# EasyEDA Pro project 16V3_EDA.eprj

# Schematic Schematic1
Board Name: Board1; Create Date: 2025-01-20; Page Name: P1; Project Name: 16V3_EDA; Schematic Name: Schematic1; Update Date: 2025-02-12; Company: 嘉立创EDA; Page Size: A4; Version: V1.0
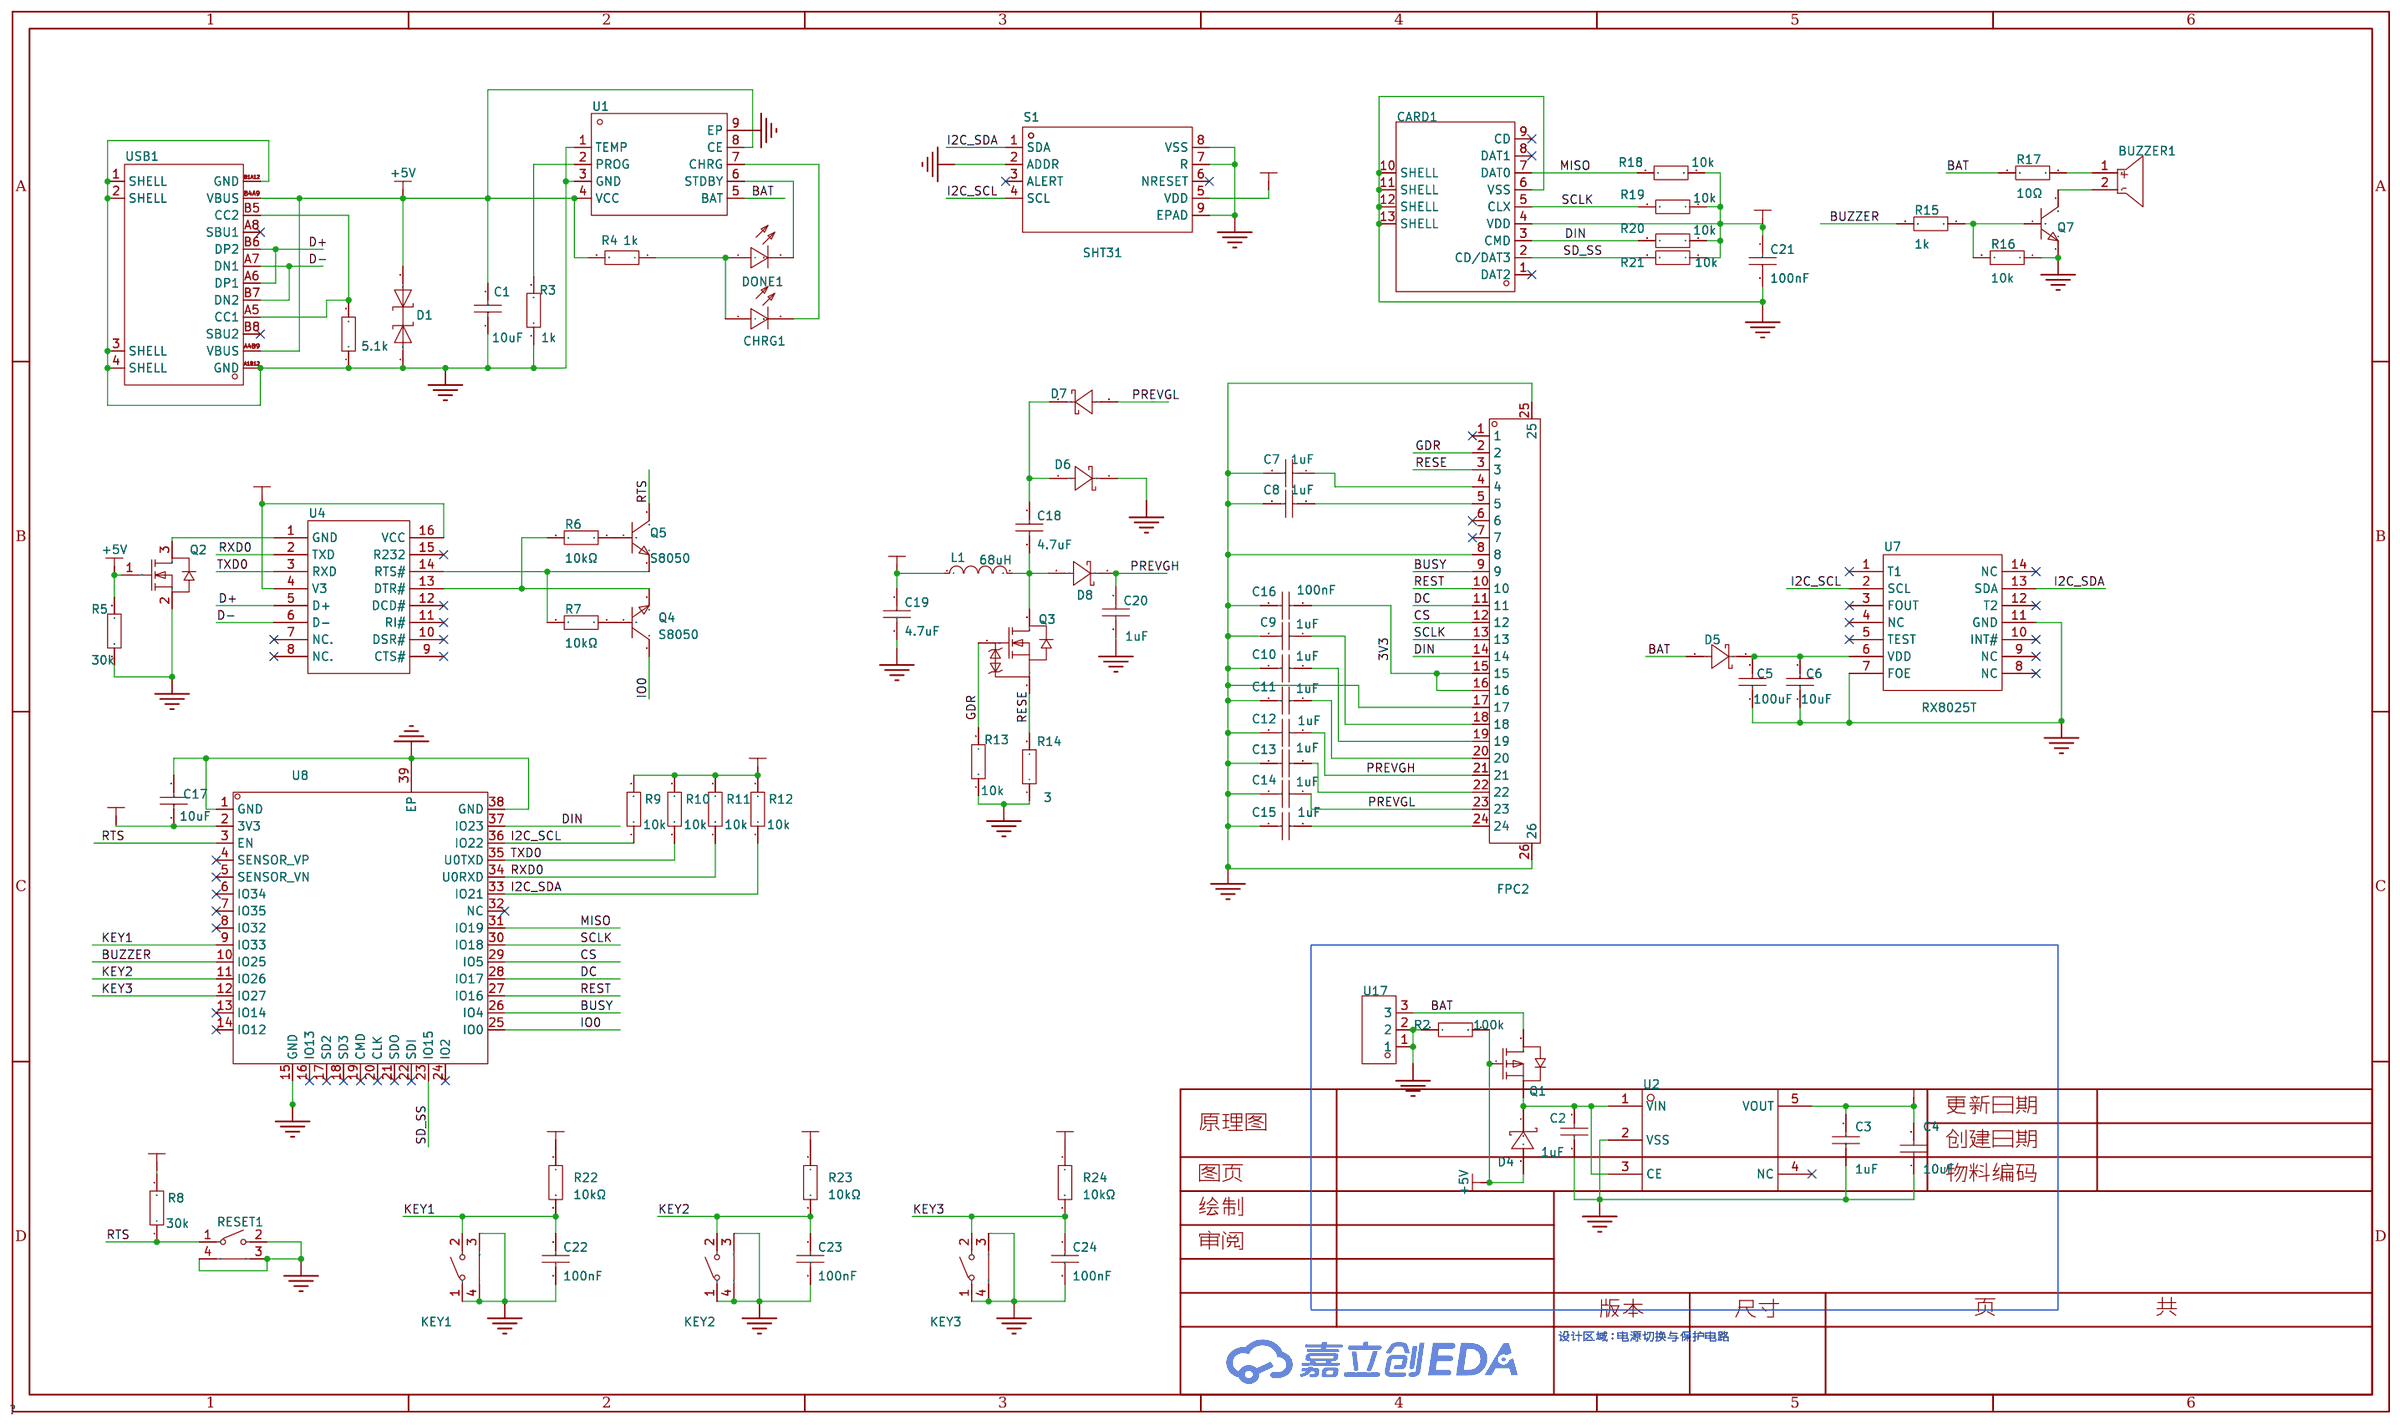
[diagram p0: schematic sheet]

## Parts
BUZZER1  FMQ-BUZZER2  [BUZ-TH_BD12.0-P7.60-D0.6-FD]
C1  10uF  [C0603]
C2  1uF  [C0603]
C3  1uF  [C0603]
C4  10uF  [C0603]
C5  100uF  [C0603]
C6  10uF  [C0603]
C7  1uF  [C0603]
C8  1uF  [C0603]
C9  1uF  [C0603]
C10  1uF  [C0603]
C11  1uF  [C0603]
C12  1uF  [C0603]
C13  1uF  [C0603]
C14  1uF  [C0603]
C15  1uF  [C0603]
C16  100nF  [C0603]
C17  10uF  [C0603]
C18  4.7uF  [C0603]
C19  4.7uF  [C0603]
C20  1uF  [C0603]
C21  100nF  [C0603]
C22  100nF  [C0603]
C23  100nF  [C0603]
C24  100nF  [C0603]
CARD1  -  [TF-SMD_THD2528-11SD-GF]
CHRG1  -  [LED0603-R-RD]
D1  -  [SOD-523_L1.2-W0.8-LS1.6-BI]
D4  -  [SMA_L4.3-W2.6-LS5.1-RD]
D5  -  [SOD-123_L2.7-W1.6-LS3.7-RD-1]
D6  -  [SOD-123_L2.7-W1.6-LS3.7-RD-1]
D7  -  [SOD-123_L2.7-W1.6-LS3.7-RD-1]
D8  -  [SOD-123_L2.7-W1.6-LS3.7-RD-1]
DONE1  -  [LED0603-R-RD]
FPC2  -  [FPC-SMD_24P-L17.5-W5.4-P0.50]
KEY1  -  [SW-SMD_L4.7-W3.5-P3.35-EH]
KEY2  -  [SW-SMD_L4.7-W3.5-P3.35-EH]
KEY3  -  [SW-SMD_L4.7-W3.5-P3.35-EH]
L1  68uH  [IND-SMD_L4.0-W4.0]
Q1  -  [SOT-23_L2.9-W1.3-P1.90-LS2.4-BR]
Q2  -  [SOT-23_L2.9-W1.3-P1.90-LS2.4-BR]
Q3  -  [SOT-323_L2.0-W1.3-P1.30-LS2.1-BR]
Q4  S8050  [SOT-23-3_L3.0-W1.7-P0.95-LS2.9-BR]
Q5  S8050  [SOT-23-3_L3.0-W1.7-P0.95-LS2.9-BR]
Q7  S8050-J3Y  [SOT-23-3_L3.0-W1.7-P0.95-LS2.9-BR]
R1  5.1k  [R0603]
R2  100k  [R0603]
R3  1k  [R0603]
R4  1k  [R0603]
R5  30k  [R0603]
R6  10kΩ  [R0603]
R7  10kΩ  [R0603]
R8  30k  [R0603]
R9  10k  [R0603]
R10  10k  [R0603]
R11  10k  [R0603]
R12  10k  [R0603]
R13  10k  [R0603]
R14  3  [R0603]
R15  1k  [R0603]
R16  10k  [R0603]
R17  10Ω  [R0603]
R18  10k  [R0603]
R19  10k  [R0603]
R20  10k  [R0603]
R21  10k  [R0603]
R22  10kΩ  [R0603]
R23  10kΩ  [R0603]
R24  10kΩ  [R0603]
RESET1  -  [SW-SMD_L4.7-W3.5-P3.35-EH]
S1  SHT31  [DFN-8_L2.5-W2.5-P0.50-BL-EP]
U1  -  [ESOP-8_L4.9-W3.9-P1.27-LS6.0-BL-EP]
U2  -  [SOT_23_5]
U4  -  [SOP-16_L10.0-W3.9-P1.27-LS6.0-BL]
U7  RX8025T  [SOIC-14_L10.0-W5.5-P1.27-LS7.8-BL]
U8  -  [WIRELM-SMD_ESP32-S]
U17  ZX-XH2.54-3PZZ  [CONN-TH_3P-P2.54_2501S-3P]
USB1  -  [USB-SMD_TYPE-611S-T3]

## Library data of the parts
BUZZER1 = FMQ-BUZZER2: Supplier Part: C9900006103; Supplier Footprint: 插件; JLCPCB Part Class: 扩展库; Supplier: LCSC
C1 C4 C6 C17 = CC0805KRX7R9BB104: 容值:100nF;精度:±10%;额定电压:50V;温度系数:X7R;; LCSC Part Name: 100nF ±10% 50V; Supplier Part: C15850; Manufacturer: YAGEO(国巨); Supplier Footprint: 0805; JLCPCB Part Class: Basic Part; Datasheet: https://atta.szlcsc.com/upload/public/pdf/source/20151026/1457707504898.pdf; Supplier: LCSC; Tolerance: ±10%; Voltage Rated: 50V; Temperature Coefficient: X7R
C2 C3 C7-C15 C20 = CC0805KRX7R9BB104: 容值:100nF;精度:±10%;额定电压:50V;温度系数:X7R;; LCSC Part Name: 100nF ±10% 50V; Supplier Part: C15849; Manufacturer: YAGEO(国巨); Supplier Footprint: 0603; JLCPCB Part Class: Basic Part; Datasheet: https://atta.szlcsc.com/upload/public/pdf/source/20151026/1457707504898.pdf; Supplier: LCSC; Tolerance: ±10%; Voltage Rated: 50V; Temperature Coefficient: X7R
C5 C18 = CC0805KRX7R9BB104: 容值:100nF;精度:±10%;额定电压:50V;温度系数:X7R;; LCSC Part Name: 100nF ±10% 50V; Supplier Part: C49678; Manufacturer: YAGEO(国巨); Supplier Footprint: 0805; JLCPCB Part Class: Basic Part; Datasheet: https://atta.szlcsc.com/upload/public/pdf/source/20151026/1457707504898.pdf; Supplier: LCSC; Tolerance: ±10%; Voltage Rated: 50V; Temperature Coefficient: X7R
C16 = CC0805KRX7R9BB104: 容值:100nF;精度:±10%;额定电压:50V;温度系数:X7R;; LCSC Part Name: 100nF ±10% 50V; Supplier Part: C14663; Manufacturer: YAGEO(国巨); Supplier Footprint: 0603; JLCPCB Part Class: Basic Part; Datasheet: https://atta.szlcsc.com/upload/public/pdf/source/20151026/1457707504898.pdf; Supplier: LCSC; Tolerance: ±10%; Voltage Rated: 50V; Temperature Coefficient: X7R
C19 = CC0805KRX7R9BB104: 容值:100nF;精度:±10%;额定电压:50V;温度系数:X7R;; LCSC Part Name: 100nF ±10% 50V; Supplier Part: C19666; Manufacturer: YAGEO(国巨); Supplier Footprint: 0603; JLCPCB Part Class: Basic Part; Datasheet: https://atta.szlcsc.com/upload/public/pdf/source/20151026/1457707504898.pdf; Supplier: LCSC; Tolerance: ±10%; Voltage Rated: 50V; Temperature Coefficient: X7R
C21 = CC0805KRX7R9BB104: 容值:100nF;精度:±10%;额定电压:50V;温度系数:X7R;; LCSC Part Name: 100nF ±10% 50V; Supplier Part: C14663; Manufacturer: YAGEO(国巨); Supplier Footprint: 0805; JLCPCB Part Class: Basic Part; Datasheet: https://atta.szlcsc.com/upload/public/pdf/source/20151026/1457707504898.pdf; Supplier: LCSC; Tolerance: ±10%; Voltage Rated: 50V; Temperature Coefficient: X7R
C22-C24 = CC0805KRX7R9BB104: 容值:100nF;精度:±10%;额定电压:50V;温度系数:X7R;; LCSC Part Name: 100nF ±10% 50V; Supplier Part: C49678; Manufacturer: YAGEO(国巨); Supplier Footprint: 0603; JLCPCB Part Class: Basic Part; Datasheet: https://atta.szlcsc.com/upload/public/pdf/source/20151026/1457707504898.pdf; Supplier: LCSC; Tolerance: ±10%; Voltage Rated: 50V; Temperature Coefficient: X7R
CARD1 = THD2528-11SD-GF: 卡连接方式:自弹式;卡类型:MicroSD卡(TF卡);连接器类型:卡座;本体最大高度:2mm;工作温度范围:-;; LCSC Part Name: 自弹式 MicroSD卡(TF卡) 卡座 外焊; Supplier Part: C283232; Manufacturer: THD(台华达); Supplier Footprint: SMD; Datasheet: https://atta.szlcsc.com/upload/public/pdf/source/20190329/C283232_532F94C79FB51CC42613BF324E8B5690.pdf; Supplier: LCSC; Card Connection Mode: 自弹式; Card Type: MicroSD卡(TF卡); Connector Type: 卡座; Maximum Body Height: 2mm; JLCPCB Part Class: Extended Part
CHRG1 = 19-217/R6C-AL1M2VY/3T: 发光颜色:红灯;二极管配置:-;透镜颜色:无色透明;主波长:617.5nm;峰值波长:632nm;色温:-;光通量(25时):-;测试电流:5mA;正向电压(VF):2.2V;发光强度:28.5mcd;功率:60mW;发光角度:120°;安装方式:-;工作温度:-40~+85;; LCSC Part Name: 0603 红灯; Supplier Part: C2286; Manufacturer: EVERLIGHT(台湾亿光); Supplier Footprint: 0603; Datasheet: https://atta.szlcsc.com/upload/public/pdf/source/20160507/1462613613821.pdf; Supplier: LCSC; Emitted Color: 红灯; Lens Color: 无色透明; Dominant Wavelength: 617.5nm; Peak Wavelength: 632nm; Forward Current: 5mA; Forward Voltage (VF): 2.2V; Luminous Intensity: 28.5mcd; Power Dissipation: 60mW; Viewing Angle: 120°; Operating Temperature: -40~+85; JLCPCB Part Class: Extended Part
D1 = ESD5Z5.0VC: 极性:双向;反向截止电压(Vrwm):5V@(最大值);击穿电压(最小值):5.6V;峰值脉冲电流(Ipp)@10/1000s:4A;最大钳位电压:12V;; LCSC Part Name: 双向 5V@(最大值); Supplier Part: C261278; Manufacturer: TC(德昌); Supplier Footprint: SOD-523; Datasheet: https://atta.szlcsc.com/upload/public/pdf/source/20180801/C261278_4236068C2349B5255C3720AC1205D526.pdf; Supplier: LCSC; Polarity: 双向; Reverse Stand-Off Voltage (Vrwm): 5V@(最大值); Breakdown Voltage (Min): 5.6V; Peak Pulse Current (Ipp)@10/1000μs: 4A; Maximum Clamping Voltage: 12V; JLCPCB Part Class: Extended Part
D4 = SS34: 直流反向耐压(Vr):40V;平均整流电流(Io):3A;正向压降(Vf):550mV@3A;; LCSC Part Name: 40V 3A 550mV@3A (SMA打扁); Supplier Part: C355267; Manufacturer: SINO-IC(光宇睿芯); Supplier Footprint: SMA; Datasheet: https://atta.szlcsc.com/upload/public/pdf/source/20190731/C355267_DFDD47B37D7A4339E7036B819780E55C.pdf; Supplier: LCSC; Reverse Voltage (Vr): 40V; Average Rectified Current (Io): 3A; Forward Voltage (Vf@If): 550mV@3A; JLCPCB Part Class: Extended Part
D5-D8 = MBR0530_C699108: 直流反向耐压(Vr):30V;平均整流电流(Io):500mA;正向压降(Vf):550mV@500mA;; LCSC Part Name: 30V 500mA 550mV@500mA; Supplier Part: C699108; Manufacturer: YANGJIE(扬杰); Manufacturer Part: MBR0530; Supplier Footprint: SOD-123; Datasheet: https://atta.szlcsc.com/upload/public/pdf/source/20200709/C699108_94C8F1A54679DD603C9696C8694A3BC2.pdf; Supplier: LCSC; Reverse Voltage (Vr): 30V; Average Rectified Current (Io): 500mA; Forward Voltage (Vf@If): 550mV@500mA; JLCPCB Part Class: Extended Part
DONE1 = 19-217/R6C-AL1M2VY/3T: 发光颜色:绿灯;二极管配置:-;透镜颜色:无色透明;主波长:617.5nm;峰值波长:632nm;色温:-;光通量(25时):-;测试电流:5mA;正向电压(VF):2.2V;发光强度:28.5mcd;功率:60mW;发光角度:120°;安装方式:-;工作温度:-40~+85;; LCSC Part Name: 0603 红灯; Supplier Part: C72043; Manufacturer: EVERLIGHT(台湾亿光); Supplier Footprint: 0603; Datasheet: https://atta.szlcsc.com/upload/public/pdf/source/20160507/1462613613821.pdf; Supplier: LCSC; Emitted Color: 绿灯; Lens Color: 无色透明; Dominant Wavelength: 617.5nm; Peak Wavelength: 632nm; Forward Current: 5mA; Forward Voltage (VF): 2.2V; Luminous Intensity: 28.5mcd; Power Dissipation: 60mW; Viewing Angle: 120°; Operating Temperature: -40~+85; JLCPCB Part Class: Extended Part
FPC2 = AFC07-S24ECC-00: 间距:0.5mm;触点数量:24;锁定特性:抽屉式;安装类型:卧贴;触点类型:上接;; LCSC Part Name: 0.5mm P数:24 抽屉式 上接; Supplier Part: C11092; Manufacturer: JS(钜硕电子); Supplier Footprint: SMD,P=0.5mm; Datasheet: https://atta.szlcsc.com/upload/public/pdf/source/20151024/1457707484416.pdf; Supplier: LCSC; Pitch: 0.5mm; Number of Contacts: 24; Locking Feature: 抽屉式; Mounting Type: 卧贴; Contact Type: 上接; Height Above Board: 2mm; FFC, FCB Thickness: 0.3mm; JLCPCB Part Class: Extended Part
KEY1-KEY3 RESET1 = GT-TC018B-H0375-L1: 触点电流:50mA;额定电压(DC):12V;绝缘电阻:100MΩ;电路结构:单刀单掷;安装方式:卧贴;按钮形状:矩形按钮;按钮/盖帽颜色:黑色;带灯:无;作用力:250gf@±30gf;机械寿命:100000;工作温度:-30~+85;引脚样式:SMD接片;开关长度:4.7mm;开关宽度:1.9mm;开关高度:3.75mm;带支架:否;; LCSC Part Name: 243.75侧按轻触开关; Supplier Part: C2762970; Manufacturer: G-Switch(品赞); Supplier Footprint: SMD; JLCPCB Part Class: Extended Part; Datasheet: https://atta.szlcsc.com/upload/public/pdf/source/20201201/C963235_1379E8FB9A9D5A830B16F6A18B8D18DC.pdf; Supplier: LCSC; Contact Current: 50mA; Voltage Rating (DC): 12V; Insulation Resistance: 100MΩ; Circuit: 单刀单掷; Mounting Style: 卧贴; Actuator Style: 矩形按钮; Actuator/Cap Color: 黑色; With Lamp: 无; Operating Force: 250gf@±30gf; Mechanical Life: 100000; Operating Temperature: -30~+85; Pin Style: SMD接片; Switch Length: 4.7mm; Switch Width: 1.9mm; Switch Height: 3.75mm; Strike Gundam: 否
L1 = CR4020-680M: 电感值:68uH;精度:±20%;额定电流:-;直流电阻(DCR):-;; LCSC Part Name: 68uH ±20%; Supplier Part: C520318; Manufacturer: ceaiya(柯爱亚); Supplier Footprint: SMD; Datasheet: https://atta.szlcsc.com/upload/public/pdf/source/20200424/C520276_8639ABF18B4A41322D74F24464FD005B.pdf; Supplier: LCSC; Tolerance: ±20%; JLCPCB Part Class: Extended Part
Q1 = SI2305: 类型:P沟道;漏源电压(Vdss):20V;连续漏极电流(Id):4.1A;功率(Pd):1.25W;导通电阻(RDS(on)@Vgs,Id):52m@4.5V,4.1A;阈值电压(Vgs(th)@Id):1V@250A;; LCSC Part Name: P沟道 20V 4.1A; Supplier Part: C344006; Manufacturer: BORN伯恩半导体; Supplier Footprint: SOT-23; Datasheet: https://atta.szlcsc.com/upload/public/pdf/source/20181211/C344006_B14C481D34E4DBCC9865316765F4D8FD.pdf; Supplier: LCSC; Type: P沟道; Drain Source Voltage (Vdss): 20V; Continuous Drain Current (Id): 4.1A; Power Dissipation (Pd): 1.25W; Drain Source On Resistance (RDS(on)@Vgs,Id): 52m@4.5V,4.1A; Gate Threshold Voltage (Vgs(th)@Id): 1V@250A; JLCPCB Part Class: Extended Part
Q2 = AO3402: LCSC Part Name: 场效应管(MOSFET); Supplier Part: C2938369; Manufacturer: GOODWORK(固得沃克); Supplier Footprint: SOT23; JLCPCB Part Class: Extended Part; Datasheet: https://atta.szlcsc.com/upload/public/pdf/source/20211229/104159C48197010484F8CEA4AB274E1B.pdf; Supplier: LCSC
Q3 = SI1308EDL-T1-GE3: 类型:N沟道;漏源电压(Vdss):30V;连续漏极电流(Id):1.4A;功率(Pd):400mW;导通电阻(RDS(on)@Vgs,Id):132m@10V,1.4A;阈值电压(Vgs(th)@Id):1.5V@250A;; LCSC Part Name: N沟道 30V 1.4A; Supplier Part: C469327; Manufacturer: VISHAY(威世); Supplier Footprint: SOT-323; Datasheet: https://atta.szlcsc.com/upload/public/pdf/source/20191217/C469327_3FE8BCBB7604A1B1F6779A1D9DD725BB.pdf; Supplier: LCSC; Type: N沟道; Drain Source Voltage (Vdss): 30V; Continuous Drain Current (Id): 1.4A; Power Dissipation (Pd): 400mW; Drain Source On Resistance (RDS(on)@Vgs,Id): 132m@10V,1.4A; Gate Threshold Voltage (Vgs(th)@Id): 1.5V@250A; JLCPCB Part Class: Extended Part
Q4 = S8050: Pin Type: IN; Supplier: LCSC; Manufacturer: CJ; image: //image.lceda.cn/szlcsc/C2146.jpg; Supplier Part: C2146; JLCPCB Part Class: 基础库
Q5 = S8050: Supplier: LCSC; Manufacturer: CJ; image: //image.lceda.cn/szlcsc/C2146.jpg; Supplier Part: C2146; JLCPCB Part Class: 基础库; JLCPCB SMD: Yes
Q7 = S8050-J3Y: Pin Type: IN; Supplier: LCSC; Supplier Part: C364312; Manufacturer: (MDD) Jiangsu Yutai Elec; JLCPCB Part Class: Extended Part
R1 = TR0603B10K0P0525Z: 电阻类型:薄膜电阻;阻值:10k;精度:±0.1%;功率:100mW;温度系数:±25ppm/;最大工作电压:75V;工作温度范围:-55~+155;; LCSC Part Name: 10k ±0.1% 100mW; Supplier Part: C23186; Manufacturer: EVER OHMS(天二科技); Supplier Footprint: 0603; JLCPCB Part Class: Extended Part; Datasheet: https://atta.szlcsc.com/upload/public/pdf/source/20190415/C188363_433BF05B6FB8F7A0F5F35A3E4390C55A.pdf; Supplier: LCSC; Type: 薄膜电阻; Tolerance: ±0.1%; Power(Watts): 100mW; Temperature Coefficient: ±25ppm/; Overload Voltage (Max): 75V; Operating Temperature Range: -55~+155
R2 = TR0603B10K0P0525Z: 电阻类型:薄膜电阻;阻值:10k;精度:±0.1%;功率:100mW;温度系数:±25ppm/;最大工作电压:75V;工作温度范围:-55~+155;; LCSC Part Name: 10k ±0.1% 100mW; Supplier Part: C25803; Manufacturer: EVER OHMS(天二科技); Supplier Footprint: 0603; JLCPCB Part Class: Extended Part; Datasheet: https://atta.szlcsc.com/upload/public/pdf/source/20190415/C188363_433BF05B6FB8F7A0F5F35A3E4390C55A.pdf; Supplier: LCSC; Type: 薄膜电阻; Tolerance: ±0.1%; Power(Watts): 100mW; Temperature Coefficient: ±25ppm/; Overload Voltage (Max): 75V; Operating Temperature Range: -55~+155
R3 R4 R15 = TR0603B10K0P0525Z: 电阻类型:薄膜电阻;阻值:10k;精度:±0.1%;功率:100mW;温度系数:±25ppm/;最大工作电压:75V;工作温度范围:-55~+155;; LCSC Part Name: 10k ±0.1% 100mW; Supplier Part: C21190; Manufacturer: EVER OHMS(天二科技); Supplier Footprint: 0603; JLCPCB Part Class: Extended Part; Datasheet: https://atta.szlcsc.com/upload/public/pdf/source/20190415/C188363_433BF05B6FB8F7A0F5F35A3E4390C55A.pdf; Supplier: LCSC; Type: 薄膜电阻; Tolerance: ±0.1%; Power(Watts): 100mW; Temperature Coefficient: ±25ppm/; Overload Voltage (Max): 75V; Operating Temperature Range: -55~+155
R5 R8 = TR0603B10K0P0525Z: 电阻类型:薄膜电阻;阻值:10k;精度:±0.1%;功率:100mW;温度系数:±25ppm/;最大工作电压:75V;工作温度范围:-55~+155;; LCSC Part Name: 10kΩ ±0.1% 100mW; Supplier Part: C22984; Manufacturer: EVER OHMS(天二科技); Supplier Footprint: 0603; JLCPCB Part Class: Extended Part; Datasheet: https://atta.szlcsc.com/upload/public/pdf/source/20190415/C188363_433BF05B6FB8F7A0F5F35A3E4390C55A.pdf; Supplier: LCSC; Type: 薄膜电阻; Tolerance: ±0.1%; Power(Watts): 100mW; Temperature Coefficient: ±25ppm/; Overload Voltage (Max): 75V; Operating Temperature Range: -55~+155
R6 R7 = TR0603B10K0P0525Z: 电阻类型:薄膜电阻;阻值:10k;精度:±0.1%;功率:100mW;温度系数:±25ppm/;最大工作电压:75V;工作温度范围:-55~+155;; LCSC Part Name: 10kΩ ±0.1% 100mW; Supplier Part: C188363; Manufacturer: EVER OHMS(天二科技); Supplier Footprint: 0603; JLCPCB Part Class: Extended Part; Datasheet: https://atta.szlcsc.com/upload/public/pdf/source/20190415/C188363_433BF05B6FB8F7A0F5F35A3E4390C55A.pdf; Supplier: LCSC; Type: 薄膜电阻; Tolerance: ±0.1%; Power(Watts): 100mW; Temperature Coefficient: ±25ppm/; Overload Voltage (Max): 75V; Operating Temperature Range: -55~+155
R9-R14 R16 R18-R24 = TR0603B10K0P0525Z: 电阻类型:薄膜电阻;阻值:10k;精度:±0.1%;功率:100mW;温度系数:±25ppm/;最大工作电压:75V;工作温度范围:-55~+155;; LCSC Part Name: 10k ±0.1% 100mW; Supplier Part: C188363; Manufacturer: EVER OHMS(天二科技); Supplier Footprint: 0603; JLCPCB Part Class: Extended Part; Datasheet: https://atta.szlcsc.com/upload/public/pdf/source/20190415/C188363_433BF05B6FB8F7A0F5F35A3E4390C55A.pdf; Supplier: LCSC; Type: 薄膜电阻; Tolerance: ±0.1%; Power(Watts): 100mW; Temperature Coefficient: ±25ppm/; Overload Voltage (Max): 75V; Operating Temperature Range: -55~+155
R17 = 0603WAF100JT5E: 电阻类型:厚膜电阻;阻值:10Ω;精度:±1%;功率:100mW;; LCSC Part Name: 10Ω ±1% 100mW; Supplier Part: C22859; Manufacturer: UNI-ROYAL(厚声); Supplier Footprint: 0603; JLCPCB Part Class: Basic Part; Datasheet: https://atta.szlcsc.com/upload/public/pdf/source/20200306/C422600_1E6D84923E4A46A82E41ADD87F860B5C.pdf; Supplier: LCSC; Type: 厚膜电阻; Tolerance: ±1%; Power(Watts): 100mW; Temperature Coefficient: ±400ppm/℃; Overload Voltage (Max): 75V; Operating Temperature Range: -55℃~+155℃
S1 = SHT31-DIS-B: 1-101386-01; Supplier: LCSC; Manufacturer: Sensirion(瑞士盛思锐); Supplier Part: C80862; JLCPCB Part Class: 扩展库; LCSC Part Name: SHT31-DIS-B2.5kS; Supplier Footprint: DFN-8-EP(2.5x2.5); Datasheet: https://atta.szlcsc.com/upload/public/pdf/source/20230202/324039AB95BA3D329FC29BEE4FBFDB91.pdf; Supply Voltage: 2.15V~5.5V
U1 = TP4056: 充电电池的类型:-;电池单元组数:-;最大充电电流:-;充满的电池组电压:-;最大供应电压:-;; Supplier Part: C725790; Manufacturer: UMW(友台半导体); Supplier Footprint: ESOP-8; Datasheet: https://atta.szlcsc.com/upload/public/pdf/source/20211011/37515E71BA298E23D23475482C49633D.pdf; Supplier: LCSC; JLCPCB Part Class: Extended Part
U2 = LDO
U4 = CH340C: 类型:Transceiver;协议类别:USB 2.0;驱动器/接收器数:-;数据速率:2Mbps;; Supplier Part: C84681; Manufacturer: WCH(南京沁恒); Supplier Footprint: SOP-16_150mil; Datasheet: https://atta.szlcsc.com/upload/public/pdf/source/20200819/C84681_ADBED554CE321879DBD6B1D06488689C.pdf; Supplier: LCSC; Type: Transceiver; Protocol: USB 2.0; Data Rate: 2Mbps; Supply Voltage: 3.3V, 5V; JLCPCB Part Class: Extended Part
U7 = RX8025T-UB: 时钟芯片类型:Clock/Calendar;存储器容量:-;时间格式:HH:MM:SS;日期格式:YY-MM-DD;接口类型:I2C;; LCSC Part Name: RX8025T-UB(X1B000281000400); Supplier Part: C17353; Manufacturer: EPSON(爱普生); Supplier Footprint: SOP-14_208mil; Datasheet: https://atta.szlcsc.com/upload/public/pdf/source/20160318/1458266986300.pdf; Supplier: LCSC; Type: Clock/Calendar; Features: Alarm; Time Format: HH:MM:SS; Date Format: YY-MM-DD; Interface: I2C; Voltage - Supply: 1.8V ~ 5.5V; Current - Timekeeping (Max): 3.4A @ 5V; JLCPCB Part Class: Extended Part
U8 = ESP32-S_1: LCSC Part Name: ESP32-S; Supplier Part: C277944; Manufacturer: Ai-Thinker(安信可); Manufacturer Part: ESP32-S; Supplier Footprint: SMD Module; Datasheet: https://atta.szlcsc.com/upload/public/pdf/source/20211217/F4BEA33E732D6002D10DAED85BBCB52B.pdf; Supplier: LCSC; JLCPCB Part Class: Extended Part
U17 = ZX-XH2.54-3PZZ: 插针结构:1x3P;间距:2.54mm;安装方式:直插;参考系列:XH;总PIN数:3P;排数:1;每排PIN数:3;行距:-;额定电流:3A;触头材质:黄铜;触头镀层:锡;工作温度范围:-25℃~+85℃;; Supplier Part: C7429633; Manufacturer: Megastar(兆星); Supplier Footprint: 插件,P=2.54mm; JLCPCB Part Class: 扩展库; Datasheet: https://atta.szlcsc.com/upload/public/pdf/source/20230619/AE17037A2CFDBE8D9CBA775D61AD0A84.pdf; Supplier: LCSC; Pins Structure: 1x3P; Pitch: 2.54mm; Mounting Style: 直插; Reference Series: XH; Number of Pins: 3P; Number of Rows: 1; Number of PINs Per Row: 3; Current Rating (Max): 3A; Contact Material: 黄铜; Contact Plating: 锡; Operating Temperature Range: -25℃~+85℃
USB1 = TYPE-611S-T3: 连接器类型:Type-C;标准:-;公母:母座;触点数量:16;端口数量:1;安装方式:卧贴;额定电流 - 电源:3A;工作温度范围:-25~+85;; LCSC Part Name: Type-C 母座 卧贴 端子镀金8.94x7.3x3.16mm; Supplier Part: C2874595; Manufacturer: Yuandi(台湾元迪); Supplier Footprint: SMD; JLCPCB Part Class: Extended Part; Datasheet: https://atta.szlcsc.com/upload/public/pdf/source/20210810/BECE640E8A6D64F3BF313A26DC5F68B7.pdf; Supplier: LCSC; Connector Type: Type-C; Gender: 母座; Number of Contacts: 16; Number of Ports: 1; Mounting Style: 卧贴; Current Rating - Power (Max): 3A; Operating Temperature Range: -25~+85

## Nets
3V3: C3.2 C4.2 C16.1 C17.1 C19.1 C21.1 CARD1.4(VDD) FPC2.15 FPC2.16 L1.1 R8.2 R9.2 R10.2 R11.2 R12.2 R18.1 R19.1 R20.1 R21.1 R22.1 R23.1 R24.1 S1.5(VDD) U2.5(VOUT) U4.4(V3) U4.16(VCC) U8.2(3V3)
+5V: C1.2 D1.2 D4.2(A) Q1.1(G) Q2.1(G) R2.2 R4.2 R5.2 U1.4(VCC) U1.8(CE) USB1.A4B9(VBUS) USB1.B4A9(VBUS)
GND: C1.1 C2.1 C3.1 C4.1 C5.1 C6.1 C7.2 C8.2 C9.2 C10.2 C11.2 C12.2 C13.2 C14.2 C15.2 C16.2 C17.2 C19.2 C20.2 C21.2 C22.2 C23.2 C24.2 CARD1.6(VSS) CARD1.10(SHELL) CARD1.11(SHELL) CARD1.12(SHELL) CARD1.13(SHELL) D1.1 D6.1(K) FPC2.8 FPC2.17 FPC2.25 FPC2.26 KEY1.1 KEY1.3 KEY1.4 KEY2.1 KEY2.3 KEY2.4 KEY3.1 KEY3.3 KEY3.4 Q2.2(S) Q7.2(E) R1.1 R2.1 R3.1 R5.1 R13.1 R14.1 R16.1 RESET1.2 RESET1.3 RESET1.4 S1.2(ADDR) S1.7(R) S1.8(VSS) S1.9(EPAD) U1.1(TEMP) U1.3(GND) U1.9(EP) U2.2(VSS) U7.7(FOE) U7.11(GND) U8.1(GND) U8.15(GND) U8.38(GND) U8.39(EP) U17.1 U17.2 USB1.1(SHELL) USB1.2(SHELL) USB1.3(SHELL) USB1.4(SHELL) USB1.A1B12(GND) USB1.B1A12(GND)
BAT: D5.2(A) Q1.3(D) R17.1 U1.5(BAT) U17.3
BUSY: FPC2.9 U8.26(IO4)
BUZZER: R15.2 U8.10(IO25)
CS: FPC2.12 U8.29(IO5)
D+: U4.5(D+) USB1.A6(DP1) USB1.B6(DP2)
D-: U4.6(D-) USB1.A7(DN1) USB1.B7(DN2)
DC: FPC2.11 U8.28(IO17)
DIN: CARD1.3(CMD) FPC2.14 R20.2 U8.37(IO23)
GDR: FPC2.2 Q3.1(G) R13.2
I2C_SCL: R9.1 S1.4(SCL) U7.2(SCL) U8.36(IO22)
I2C_SDA: R12.1 S1.1(SDA) U7.13(SDA) U8.33(IO21)
IO0: Q4.3(C) U8.25(IO0)
KEY1: C22.1 KEY1.2 R22.2 U8.9(IO33)
KEY2: C23.1 KEY2.2 R23.2 U8.11(IO26)
KEY3: C24.1 KEY3.2 R24.2 U8.12(IO27)
MISO: CARD1.7(DAT0) R18.2 U8.31(IO19)
PREVGH: C12.1 C20.1 D8.1(K) FPC2.21
PREVGL: C14.1 D7.2(A) FPC2.23
RESE: FPC2.3 Q3.2(S) R14.2
REST: FPC2.10 U8.27(IO16)
RTS: Q5.3(C) R8.1 RESET1.1 U8.3(EN)
RXD0: R11.1 U4.2(TXD) U8.34(U0RXD)
SCLK: CARD1.5(CLX) FPC2.13 R19.2 U8.30(IO18)
SD_SS: CARD1.2(CD/DAT3) R21.2 U8.23(IO15)
TXD0: R10.1 U4.3(RXD) U8.35(U0TXD)
$1N1008: C7.1 FPC2.4
$1N1009: C8.1 FPC2.5
$1N1010: C15.1 FPC2.24
$1N1013: C13.1 FPC2.22
$1N1016: C11.1 FPC2.20
$1N1017: C9.1 FPC2.18
$1N1018: C10.1 FPC2.19
$1N1037: C18.2 D8.2(A) L1.2 Q3.3(D)
$1N1038: C18.1 D6.2(A) D7.1(K)
$1N3398: R3.2 U1.2(PROG)
$1N3399: CHRG1.1(A) DONE1.1(A) R4.1
$1N3400: DONE1.2(C) U1.6(STDBY)
$1N3401: CHRG1.2(C) U1.7(CHRG)
$1N3410: R1.2 USB1.A5(CC1) USB1.B5(CC2)
$1N4072: Q2.3(D) U4.1(GND)
$1N4223: Q5.2(E) R7.2 U4.14(RTS#)
$1N5097: Q5.1(B) R6.1
$1N5158: Q4.1(B) R7.1
$1N5192: Q4.2(E) R6.2 U4.13(DTR#)
$1N5475: BUZZER1.2 Q7.3(C)
$1N5476: Q7.1(B) R15.1 R16.2
$1N5477: BUZZER1.1 R17.2
$1N22750: C5.2 C6.2 D5.1(K) U7.6(VDD)
$1N29241: C2.2 D4.1(C) Q1.2(S) U2.1(VIN) U2.3(CE)

Not connected (* = marked no-connect by the designer): CARD1 1(DAT2)* 8(DAT1)* 9(CD)*; FPC2 1* 6* 7*; S1 3(ALERT)* 6(NRESET)*; U2 4(NC)*; U4 7(NC.)* 8(NC.)* 9(CTS#)* 10(DSR#)* 11(RI#)* 12(DCD#)* 15(R232)*; U7 1(T1)* 3(FOUT)* 4(NC)* 5(TEST)* 8(NC)* 9(NC)* 10(INT#)* 12(T2)* 14(NC)*; U8 4(SENSOR_VP)* 5(SENSOR_VN)* 6(IO34)* 7(IO35)* 8(IO32)* 13(IO14)* 14(IO12)* 16(IO13)* 17(SD2)* 18(SD3)* 19(CMD)* 20(CLK)* 21(SDO)* 22(SDI)* 24(IO2)* 32(NC)*; USB1 A8(SBU1)* B8(SBU2)*

## Notes on the sheet
- 设计区域：电源切换与保护电路

# Board PCB
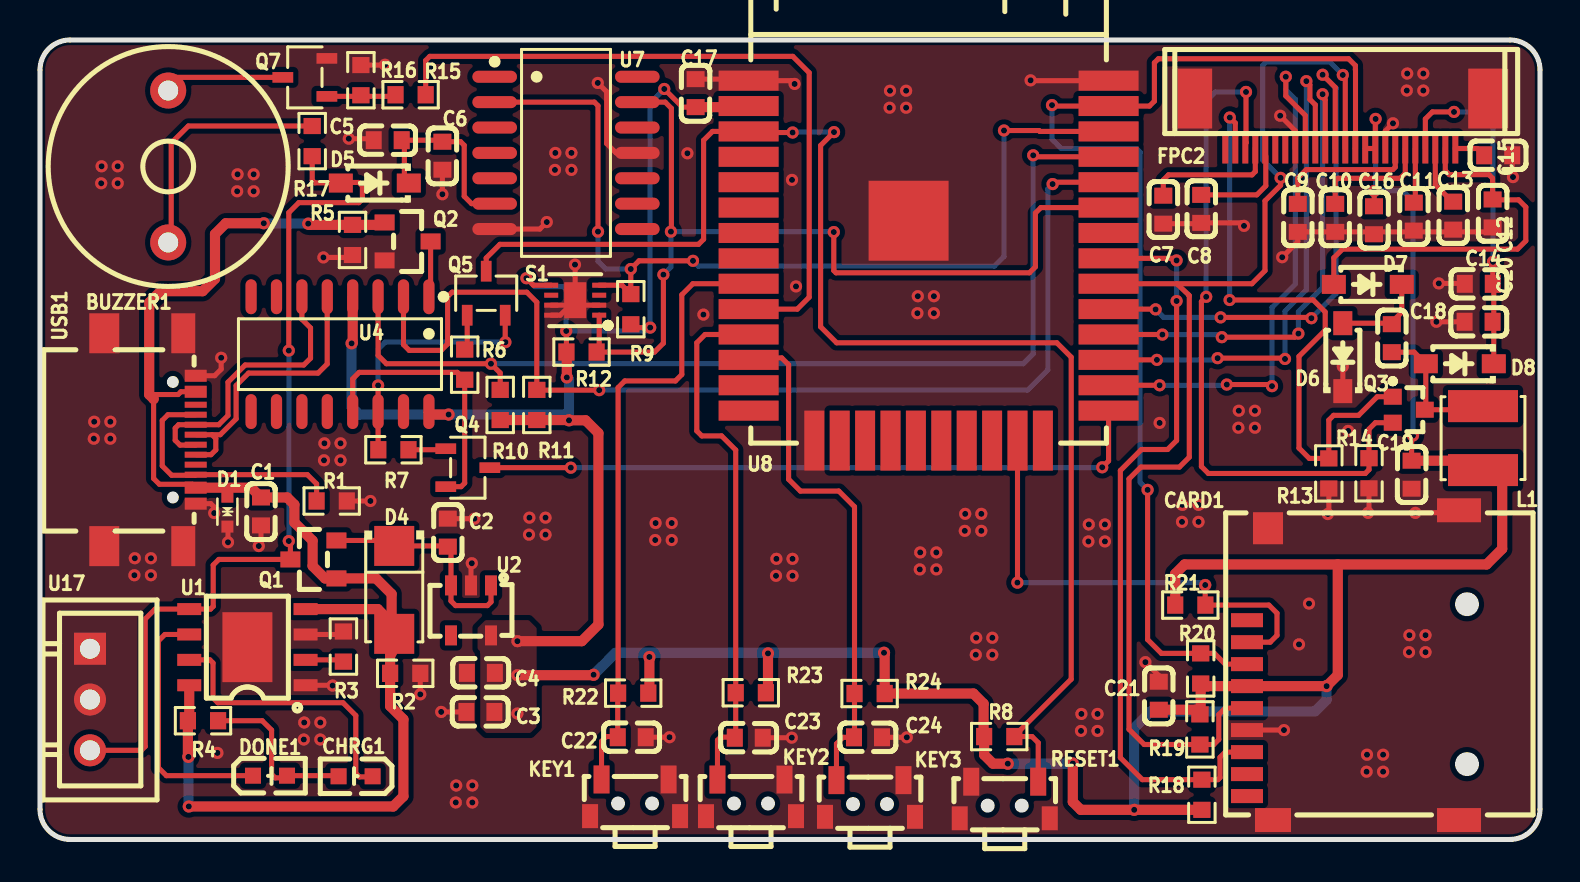
[diagram p1: board, top side]
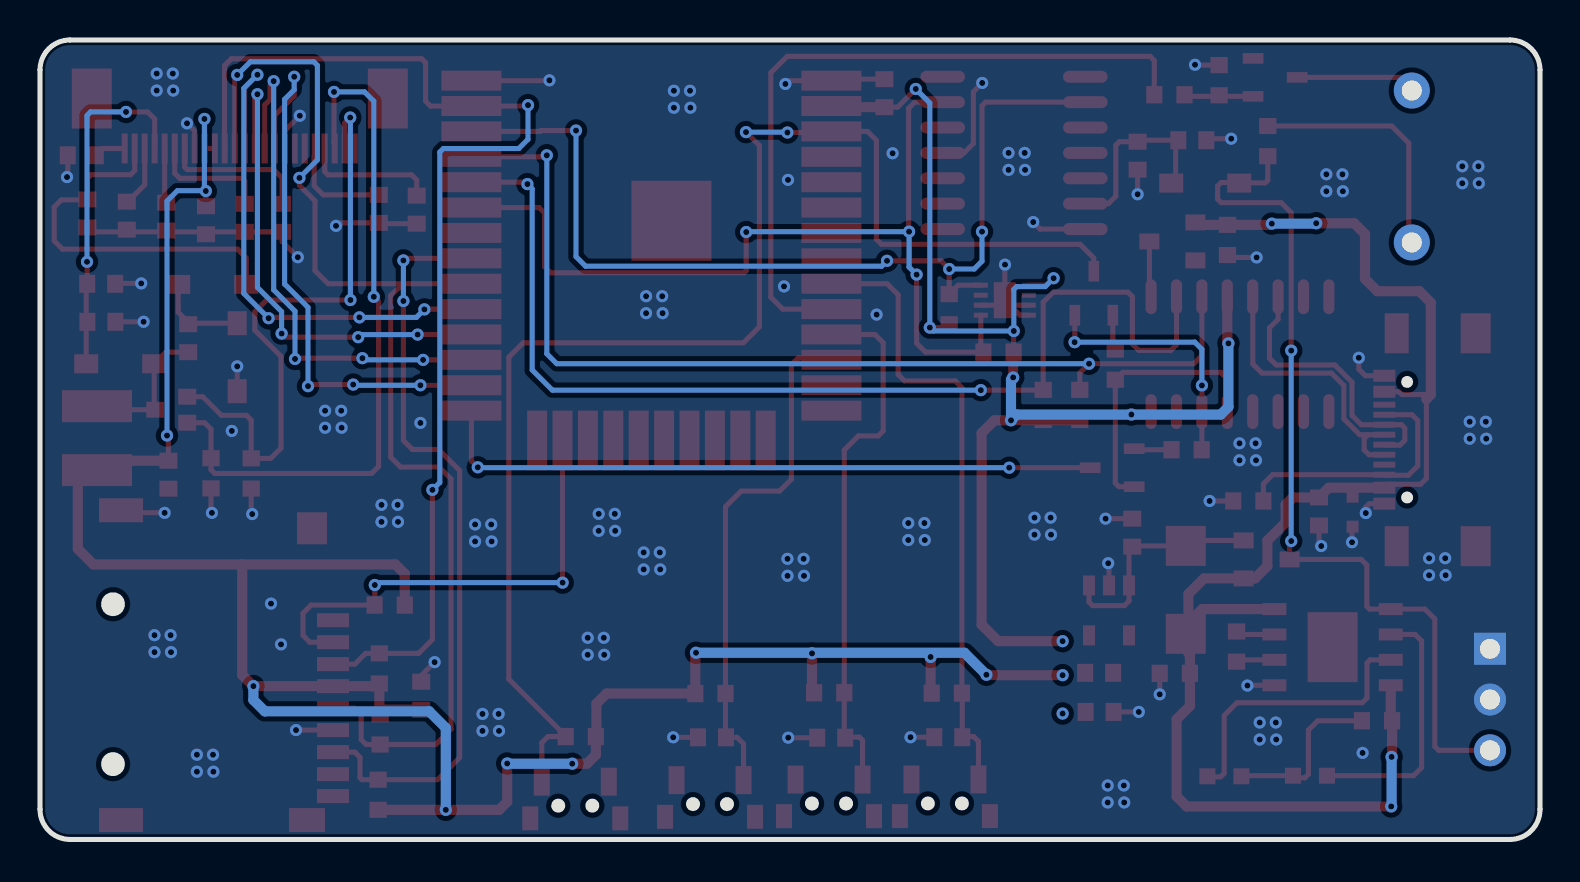
[diagram p2: board, bottom side, seen from below]

Outline 75 x 40 mm; copper layers: Top Layer, Inner1, Inner2, Inner3, Inner4, Inner5, Inner6, Inner7, Inner8, Inner9, Inner10, Inner11, Inner12, Inner13, Inner14, Inner15, Inner16, Inner17, Inner18, Inner19, Inner20, Inner21, Inner22, Inner23, Inner24, Inner25, Inner26, Inner27, Inner28, Inner29, Inner30, Bottom Layer. Coordinates in mm from the lower left corner of the outline.
Outline path: 0,38.5 0,1.5 arc(0.44,0.44) 1.5,0 73.5,0 arc(74.56,0.44) 75,1.5 75,38.5 arc(74.56,39.56) 73.5,40 1.5,40 arc(0.44,39.56) 0,38.5
Stack: Top Layer 0.035mm / Dielectric1 1.51mm FR4 er 4.5 / Bottom Layer 0.035mm

## Design rules (mm)
net D+: DP1
net D-: DP1
template: 自定义配置
spacing copperThickness1oz (default): track to track 0.178, other pairs 0.152 to 0.203
spacing copperThickness2oz: track to track 0.203, other pairs 0.152 to 0.3
track width copperThickness1oz (default): min 0.254, default 0.254, max 0.508
track width copperThickness2oz: min 0.203, default 0.254, max 2.54
differential pair differentialPair (default): width min 0.254, default 0.254, max 0.508; gap min 0.152, default 0.152
via viaSize (default): diameter min 0.61, default 0.61, max 0.61; hole min 0.305, default 0.305, max 0.305

## Placement (name value [footprint] x y rotation side)
BUZZER1  FMQ-BUZZER2  [BUZ-TH_BD12.0-P7.60-D0.6-FD]  6.41 33.67 90 top
C1  10uF  [C0603]  11.05 16.41 90 top
C2  1uF  [C0603]  20.39 15.35 270 top
C3  1uF  [C0603]  22.02 6.38 0 top
C4  10uF  [C0603]  22.04 8.34 0 top
C5  100uF  [C0603]  17.39 34.99 0 top
C6  10uF  [C0603]  20.12 34.21 90 top
C7  1uF  [C0603]  56.16 31.51 270 top
C8  1uF  [C0603]  58.06 31.55 270 top
C9  1uF  [C0603]  62.89 31.1 270 top
C10  1uF  [C0603]  64.76 31.1 270 top
C11  1uF  [C0603]  68.69 31.16 270 top
C12  1uF  [C0603]  71.94 27.8 180 top
C13  1uF  [C0603]  70.66 31.21 270 top
C14  1uF  [C0603]  72.63 31.32 270 top
C15  1uF  [C0603]  72.91 34.23 0 top
C16  100nF  [C0603]  66.7 30.98 270 top
C17  10uF  [C0603]  32.78 37.34 90 top
C18  4.7uF  [C0603]  67.59 25.08 270 top
C19  4.7uF  [C0603]  68.58 18.25 270 top
C20  1uF  [C0603]  71.93 25.9 180 top
C21  100nF  [C0603]  55.94 7.19 90 top
C22  100nF  [C0603]  29.59 5.11 0 top
C23  100nF  [C0603]  35.44 5.09 0 top
C24  100nF  [C0603]  41.4 5.11 0 top
CARD1  -  [TF-SMD_THD2528-11SD-GF]  65.65 8.72 90 top
CHRG1  -  [LED0603-R-RD]  15.78 3.16 180 top
D1  -  [SOD-523_L1.2-W0.8-LS1.6-BI]  9.37 16.4 90 top
D4  -  [SMA_L4.3-W2.6-LS5.1-RD]  17.71 12.49 270 top
D5  -  [SOD-123_L2.7-W1.6-LS3.7-RD-1]  16.74 32.84 180 top
D6  -  [SOD-123_L2.7-W1.6-LS3.7-RD-1]  65.14 24.13 90 top
D7  -  [SOD-123_L2.7-W1.6-LS3.7-RD-1]  66.39 27.77 180 top
D8  -  [SOD-123_L2.7-W1.6-LS3.7-RD-1]  70.99 23.8 180 top
DONE1  -  [LED0603-R-RD]  11.5 3.19 0 top
FPC2  -  [FPC-SMD_24P-L17.5-W5.4-P0.50]  65.01 35.82 180 top
KEY1  -  [SW-SMD_L4.7-W3.5-P3.35-EH]  29.75 2.08 180 top
KEY2  -  [SW-SMD_L4.7-W3.5-P3.35-EH]  35.55 2.08 180 top
KEY3  -  [SW-SMD_L4.7-W3.5-P3.35-EH]  41.5 2.05 180 top
L1  68uH  [IND-SMD_L4.0-W4.0]  72.15 20.08 90 top
Q1  -  [SOT-23_L2.9-W1.3-P1.90-LS2.4-BR]  13.67 14.01 0 top
Q2  -  [SOT-23_L2.9-W1.3-P1.90-LS2.4-BR]  18.38 29.92 180 top
Q3  -  [SOT-323_L2.0-W1.3-P1.30-LS2.1-BR]  68.44 21.5 180 top
Q4  S8050  [SOT-23-3_L3.0-W1.7-P0.95-LS2.9-BR]  21.39 18.6 180 top
Q5  S8050  [SOT-23-3_L3.0-W1.7-P0.95-LS2.9-BR]  22.31 27.33 270 top
Q7  S8050-J3Y  [SOT-23-3_L3.0-W1.7-P0.95-LS2.9-BR]  13.24 38.13 0 top
R1  5.1k  [R0603]  14.58 16.93 180 top
R2  100k  [R0603]  18.26 8.31 180 top
R3  1k  [R0603]  15.17 9.65 270 top
R4  1k  [R0603]  8.15 5.94 180 top
R5  30k  [R0603]  15.63 29.99 90 top
R6  10kΩ  [R0603]  21.23 23.76 270 top
R7  10kΩ  [R0603]  17.67 19.5 180 top
R8  30k  [R0603]  47.96 5.15 180 top
R9  10k  [R0603]  29.54 26.53 270 top
R10  10k  [R0603]  23.01 21.74 270 top
R11  10k  [R0603]  24.84 21.74 270 top
R12  10k  [R0603]  27.08 24.38 180 top
R13  10k  [R0603]  64.44 18.31 90 top
R14  3  [R0603]  66.45 18.32 90 top
R15  1k  [R0603]  18.53 37.26 0 top
R16  10k  [R0603]  16.05 37.99 270 top
R17  10Ω  [R0603]  13.61 34.94 90 top
R18  10k  [R0603]  58.09 2.24 90 top
R19  10k  [R0603]  57.99 5.5 270 top
R20  10k  [R0603]  58.03 8.56 90 top
R21  10k  [R0603]  57.52 11.73 0 top
R22  10kΩ  [R0603]  29.66 7.32 180 top
R23  10kΩ  [R0603]  35.54 7.34 180 top
R24  10kΩ  [R0603]  41.48 7.3 180 top
RESET1  -  [SW-SMD_L4.7-W3.5-P3.35-EH]  48.24 1.97 180 top
S1  SHT31  [DFN-8_L2.5-W2.5-P0.50-BL-EP]  26.76 26.98 90 top
U1  -  [ESOP-8_L4.9-W3.9-P1.27-LS6.0-BL-EP]  10.37 9.62 90 top
U2  -  [SOT_23_5]  22.55 12.71 90 top
U4  -  [SOP-16_L10.0-W3.9-P1.27-LS6.0-BL]  15 24.28 180 top
U7  RX8025T  [SOIC-14_L10.0-W5.5-P1.27-LS7.8-BL]  26.3 34.35 270 top
U8  -  [WIRELM-SMD_ESP32-S]  44.43 28.96 0 top
U17  ZX-XH2.54-3PZZ  [CONN-TH_3P-P2.54_2501S-3P]  2.5 7 270 top
USB1  -  [USB-SMD_TYPE-611S-T3]  5.5 20 270 top

## Footprints (pads in the part's own frame, mm; a bottom-side part is the same pattern mirrored in y, then rotated)
BUZ-TH_BD12.0-P7.60-D0.6-FD
  round 1.8 hole 1: 1(-3.8,0) 2(3.8,0)
C0603
  rect 0.8x0.9 smd: 1(-0.7,0) 2(0.7,0)
CONN-TH_3P-P2.54_2501S-3P
  rect 1.6x1.6 hole 1: 1(-2.54,0)
  round 1.6 hole 1: 2(0,0) 3(2.54,0)
DFN-8_L2.5-W2.5-P0.50-BL-EP
  rect 0.25x0.7 smd: 1(-0.75,-1.2) 2(-0.25,-1.2) 3(0.25,-1.2) 4(0.75,-1.2) 5(0.75,1.2) 6(0.25,1.2) 7(-0.25,1.2) 8(-0.75,1.2)
  rect 1.8x1.1 smd: 9(0,0)
ESOP-8_L4.9-W3.9-P1.27-LS6.0-BL-EP
  rect 0.6x1.199 smd: 1(-1.905,-2.909) 2(-0.635,-2.909) 3(0.635,-2.909) 4(1.905,-2.909) 5(1.905,2.909) 6(0.635,2.909) 7(-0.635,2.909) 8(-1.905,2.909)
  rect 3.5x2.499 smd: 9(0,0)
FPC-SMD_24P-L17.5-W5.4-P0.50
  rect 0.299x1.501 smd: 1(5.745,1.25) 2(5.245,1.25) 3(4.745,1.25) 4(4.245,1.25) 5(3.747,1.25) 6(3.246,1.25) 7(2.745,1.25) 8(2.245,1.25) 9(1.745,1.25) 10(1.244,1.25) 11(0.747,1.25) 12(0.246,1.25) 13(-0.254,1.25) 14(-0.754,1.25) 15(-1.25,1.25) 16(-1.755,1.25) 17(-2.256,1.25) 18(-2.753,1.25) 19(-3.253,1.25) 20(-3.756,1.25) 21(-4.257,1.25) 22(-4.755,1.25) 23(-5.255,1.25) 24(-5.755,1.25)
  rect 1.999x2.999 smd: 25(-7.402,-1.25) 26(7.402,-1.25)
IND-SMD_L4.0-W4.0
  rect 1.6x3.5 smd: 1(-1.6,0) 2(1.6,0)
LED0603-R-RD
  rect 0.8x0.8 smd: 1(0.851,0) 2(-0.851,0)
R0603
  rect 0.807x0.864 smd: 1(-0.754,0) 2(0.754,0)
SMA_L4.3-W2.6-LS5.1-RD
  rect 1.999x1.999 smd: 1(-2.2,0) 2(2.2,0)
SOD-123_L2.7-W1.6-LS3.7-RD-1
  rect 1.199x0.95 smd: 1(-1.7,0) 2(1.7,0)
SOD-523_L1.2-W0.8-LS1.6-BI
  rect 0.6x0.6 smd: 1(-0.75,0) 2(0.75,0)
SOIC-14_L10.0-W5.5-P1.27-LS7.8-BL
  oval 0.602x2.23 smd: 1(-3.81,-3.566) 2(-2.54,-3.566) 3(-1.27,-3.566) 4(0,-3.566) 5(1.27,-3.566) 6(2.54,-3.566) 7(3.81,-3.566) 8(3.81,3.566) 9(2.54,3.566) 10(1.27,3.566) 11(0,3.566) 12(-1.27,3.566) 13(-2.54,3.566) 14(-3.81,3.566)
SOP-16_L10.0-W3.9-P1.27-LS6.0-BL
  oval 0.559x1.745 smd: 1(-4.445,-2.873) 2(-3.175,-2.873) 3(-1.905,-2.873) 4(-0.635,-2.873) 5(0.635,-2.873) 6(1.905,-2.873) 7(3.175,-2.873) 8(4.445,-2.873) 9(4.445,2.873) 10(3.175,2.873) 11(1.905,2.873) 12(0.635,2.873) 13(-0.635,2.873) 14(-1.905,2.873) 15(-3.175,2.873) 16(-4.445,2.873)
SOT-23-3_L3.0-W1.7-P0.95-LS2.9-BR
  rect 1.038x0.532 smd: 1(1.101,-0.95) 2(1.101,0.95) 3(-1.101,0)
SOT-23_L2.9-W1.3-P1.90-LS2.4-BR
  rect 1.001x0.8 smd: 1(1.151,-0.95) 2(1.151,0.95) 3(-1.151,0)
SOT-323_L2.0-W1.3-P1.30-LS2.1-BR
  rect 0.899x0.8 smd: 1(0.8,-0.65) 2(0.8,0.65) 3(-0.8,0)
SOT_23_5
  rect 1x0.6 smd: 1(0,0) 2(0,1) 3(0,2) 4(-2.5,2) 5(-2.5,0)
SW-SMD_L4.7-W3.5-P3.35-EH
  rect 0.8x1.399 smd: 1(-1.674,-0.917) 2(1.677,-0.917)
  rect 0.8x1.199 smd: 3(-2.251,0.917) 4(2.251,0.917)
TF-SMD_THD2528-11SD-GF
  rect 0.701x1.6 smd: 1(2.251,5.301) 2(1.151,5.301) 3(0.051,5.301) 4(-1.049,5.301) 5(-2.149,5.301) 6(-3.248,5.301) 7(-4.351,5.301) 8(-5.451,5.301) 9(-6.551,5.301)
  rect 1.199x1.801 smd: 10(-7.75,4)
  rect 1.199x2.2 smd: 11(-7.75,-5.301) 12(7.75,-5.301)
  rect 1.6x1.501 smd: 13(6.851,4.25)
USB-SMD_TYPE-611S-T3
  rect 2x1.2 smd: 1(-5.325,1.665) 2(5.325,1.665)
  rect 2x1.5 smd: 3(5.325,-2.285) 4(-5.325,-2.285)
  rect 0.6x1.1 smd: A1B12(-3.2,2.285) A4B9(-2.4,2.285) B1A12(3.2,2.285) B4A9(2.4,2.285)
  rect 0.3x1.1 smd: A5(-1.25,2.285) A6(-0.25,2.285) A7(0.25,2.285) A8(1.25,2.285) B5(1.75,2.285) B6(0.75,2.285) B7(-0.75,2.285) B8(-1.75,2.285)
WIRELM-SMD_ESP32-S
  rect 2.999x1.001 smd: 1(-8.999,9.005) 2(-8.999,7.734) 3(-8.999,6.465) 4(-8.999,5.194) 5(-8.999,3.925) 6(-8.999,2.655) 7(-8.999,1.385) 8(-8.999,0.115) 9(-8.999,-1.155) 10(-8.999,-2.425) 11(-8.999,-3.696) 12(-8.999,-4.965) 13(-8.999,-6.236) 14(-8.999,-7.505) 25(8.999,-7.505) 26(8.999,-6.236) 27(8.999,-4.965) 28(8.999,-3.696) 29(8.999,-2.425) 30(8.999,-1.155) 31(8.999,0.115) 32(8.999,1.385) 33(8.999,2.655) 34(8.999,3.925) 35(8.999,5.194) 36(8.999,6.465) 37(8.999,7.734) 38(8.999,9.005)
  rect 1.001x2.999 smd: 15(-5.715,-9.005) 16(-4.445,-9.005) 17(-3.175,-9.005) 18(-1.905,-9.005) 19(-0.635,-9.005) 20(0.635,-9.005) 21(1.905,-9.005) 22(3.175,-9.005) 23(4.445,-9.005) 24(5.715,-9.005)
  rect 4x4 smd: 39(-1.001,1.996)

## Nets
As in the schematic.

Pads without a net: CARD1 1 8 9; FPC2 1 6 7; S1 3 6; U2 4; U4 7 8 9 10 11 12 15; U7 1 3 4 5 8 9 10 12 14; U8 4 5 6 7 8 13 14 16 17 18 19 20 21 22 24 32; USB1 A8 B8

## Via types
v1: diameter 0.61, hole 0.305, Top Layer to Bottom Layer, 211 vias

## Routing (per net, layer and track width the routed paths; a pad name or vN(x,y) marks a point on that pad's centre or on a via; arc(x,y) is an arc through that point)
3V3: length 195
  Top Layer w0.254: C19.1 68.58,20.14 v1(68.65,20.21) ; v1(26.31,25.44) 26.32,25.43 R12.2 ; 66.72,31.72 66.71,31.73 v1(66.71,32.44) ; S1.5 24.67,27.73 v1(24.32,28.08) ; C17.1 32.12,36.64 v1(31.21,37.55) ; v1(30.51,25.61) 29.71,25.61 R9.2 ; FPC2.15 FPC2.16 66.76,36.03 v1(66.78,36.05)
  Top Layer w0.508: v1(27.68,8.24) 27.66,8.22 v1(23.87,8.22) ; C19.1 71.68,18.95 L1.1 73.1,18.48 73.11,18.47 73.11,14.54 72.33,13.76 64.89,13.76 ; v1(30.47,9.13) 30.47,7.38 R22.1 ; v1(42.2,9.34) 42.23,9.31 R24.1 46.67,7.3 47.18,6.79 47.18,5.17 R8.2 47.21,4.23 47.65,3.79 v1(48.39,3.79) ; v1(20.43,21.26) 19.59,21.26 U4.16 ; v1(26.34,23.11) 26.34,24.36 R12.2 ; 35.43,36.69 35.38,36.64 C17.1 ; v1(15.58,24.82) 15.64,24.88 U4.4 ; R18.1 v1(54.71,1.48) 52.04,1.48 51.64,1.88 v1(51.64,3.8) ; C21.1 57.76,6.49 57.99,6.26 58.03,6.3 R20.1 58.16,7.67 v1(64.33,7.67) 64.89,8.23 64.89,13.76 ; 64.89,13.76 57.23,13.76 56.76,13.29 R21.1 ; R10.2 R11.2 26.44,20.98 v1(26.45,20.97) 27.28,20.97 27.92,20.33 27.92,10.75 27.09,9.92 v1(23.87,9.92) ; R23.1 36.4,7.45 v1(36.4,9.31)
  Bottom Layer w0.254: 66.73,32.46 66.78,32.51 v1(66.78,36.05) ; 66.73,32.46 68.13,32.46 68.65,31.94 v1(68.65,20.21) ; 66.73,32.46 v1(66.71,32.44) ; v1(24.32,28.08) 24.74,27.66 26.17,27.66 26.31,27.52 v1(26.31,25.44) 30.34,25.44 v1(30.51,25.61) 30.51,36.85 v1(31.21,37.55)
  Bottom Layer w0.508: v1(15.58,24.82) 15.58,21.64 15.96,21.26 v1(20.43,21.26) 26.16,21.26 v1(26.45,20.97) 26.45,23.01 v1(26.34,23.11) ; v1(36.4,9.31) 36.4,9.34 ; v1(54.71,1.48) 54.71,5.58 55.54,6.41 63.76,6.41 64.33,6.98 v1(64.33,7.67) ; v1(48.39,3.79) 51.63,3.79 v1(51.64,3.8) ; v1(42.2,9.34) 28.78,9.34 v1(27.68,8.24) ; v1(30.47,9.13) 30.47,9.27
  vias: v1(23.87,6.3)
+5V: length 73.7
  Top Layer w0.254: USB1.A4B9 7.05,22.4 6.91,22.26 5.68,22.26 5.68,22.04 ; USB1.B4A9 7.62,17.77 5.97,17.77 5.68,18.06 5.68,22.03
  Top Layer w0.508: 17.58,10.83 17.58,12.28 16.8,13.06 Q1.1 14.25,13.06 13.63,13.68 13.63,14.95 12.72,15.86 12.72,16.75 12.36,17.11 C1.2 10.56,17.6 USB1.B4A9 ; 17.58,10.83 16.89,11.53 U1.4 ; 17.58,10.83 17.58,9.32 17.51,9.25 R2.2 17.51,6.67 18.17,6.01 18.17,2.16 17.66,1.65 v1(7.44,1.65) ; v1(13.41,30.81) 13.47,30.75 R5.2 17.11,30.75 Q2.1 ; v1(11.19,30.83) 9.29,30.83 8.75,30.29 8.75,28.05 8.13,27.43 6.03,27.43 5.46,26.86 5.46,22.26 5.68,22.04 5.68,22.03 ; U1.8 7.46,6.01 R4.2 7.4,4.15 v1(7.42,4.13)
  Bottom Layer w0.508: v1(13.41,30.81) 11.21,30.81 v1(11.19,30.83) ; v1(7.42,4.13) 7.42,1.67 v1(7.44,1.65)
GND: length 77.3
  Top Layer w0.254: v1(9.06,24.1) 9.06,23.53 8.73,23.2 USB1.A1B12 ; FPC2.8 62.76,35.46 v1(62.01,36.21) ; v1(21.59,13.82) 21.55,13.78 U2.2 ; v1(62.11,29.13) 62.89,29.91 C9.2 C10.2 72.41,30.4 C14.2 ; v1(37.59,5.09) 37.59,5.09 C23.2 ; FPC2.17 67.27,35.45 v1(67.65,35.83) ; v1(37.73,37.8) 37.57,37.96 35.43,37.96 35.35,38.04 C17.2 ; U8.38 49.55,37.96 v1(49.53,37.98) ; USB1.B1A12 8.54,16.8 8.71,16.63 v1(8.71,16.33) ; v1(27.89,37.85) 28.33,37.41 28.33,34.82 28.8,34.35 U7.11 ; C2.1 v1(21.72,16.05) 21.73,16.04 ; R2.1 v1(19.01,7.26) ; v1(60.2,30.7) 60.05,30.85 C8.2 58.02,30.81 C7.2 ; U1.1 14.61,7.72 v1(14.63,7.7) ; C21.2 55.94,8.2 v1(55.27,8.87) ; R3.1 15.02,10.25 U1.3 ; 66.48,16.39 66.45,16.42 R14.1 ; C5.1 16.61,35.06 v1(15.44,35.06) ; 65.13,23.68 v1(65.14,23.67) D6.1 ; v1(73.65,33.14) 73.61,33.18 C15.2 ; 31.52,5.07 v1(31.48,5.11) 30.29,5.11 ; C3.1 v1(20.06,6.38) ; 68.78,16.35 70.83,16.35 CARD1.12 ; v1(64.39,16.28) 64.44,16.33 R13.1 ; 60.35,5.47 v1(62.2,5.47) ; C20.2 v1(69.82,25.9) ; 20.15,32.25 v1(20.12,32.28) C6.1 ; v1(10.94,14.68) 11.05,14.79 C1.1 ; C12.2 71.22,27.82 v1(69.94,27.82) ; v1(17.25,38.76) 17.23,38.74 R16.1 ; v1(9.4,14.87) 9.4,15.62 D1.1 ; R5.1 15.51,29.12 v1(14.17,29.12) ; 15.34,16.93 v1(16.52,16.93) ; v1(26.75,28.76) 26.76,28.75 S1.9 27.01,26.73 S1.2 ; S1.7 26.51,26.73 26.01,26.23 S1.8 ; U7.7 24.99,30.54 v1(25.34,30.89) ; C24.2 v1(43.34,5.11)
  vias: v1(2.71,20.9) v1(2.69,20.05) v1(3.08,33.68) v1(3.06,32.83) v1(3.52,20.9) v1(3.52,20.05) v1(3.89,33.68) v1(3.89,32.83) v1(4.74,14.07) v1(4.72,13.22) v1(5.55,14.07) v1(5.55,13.22) v1(8.87,4.33) v1(9.88,33.28) v1(9.86,32.43) v1(10.68,33.28) v1(10.68,32.43) v1(13.21,5.85) v1(13.19,5) v1(14.02,5.85) v1(14.02,5) v1(14.22,19.82) v1(14.2,18.97) v1(15.03,19.82) v1(15.03,18.97) v1(20.81,2.7) v1(20.79,1.85) v1(21.62,2.7) v1(21.62,1.85) v1(24.45,15.25) v1(24.47,16.1) v1(25.28,16.1) v1(25.28,15.25) v1(25.75,33.5) v1(25.77,34.35) v1(26.57,34.35) v1(26.57,33.5) v1(30.78,15.83) v1(30.76,14.98) v1(31.59,15.83) v1(31.59,14.98) v1(32.37,34.33) v1(33.17,26.26) v1(36.82,14.04) v1(36.8,13.19) v1(37.6,33) v1(37.63,14.04) v1(37.63,13.19) v1(37.8,27.67) v1(42.5,37.46) v1(42.48,36.61) v1(43.31,37.46) v1(43.31,36.61) v1(43.89,27.18) v1(43.87,26.33) v1(44.01,14.36) v1(43.99,13.51) v1(44.7,27.18) v1(44.7,26.33) v1(44.82,14.36) v1(44.82,13.51) v1(46.24,15.44) v1(46.26,16.29) v1(46.81,10.09) v1(46.79,9.24) v1(47.07,16.29) v1(47.07,15.44) v1(47.62,10.09) v1(47.62,9.24) v1(52.07,6.28) v1(52.05,5.43) v1(52.44,15.76) v1(52.42,14.91) v1(52.88,6.28) v1(52.88,5.43) v1(53.25,15.76) v1(53.25,14.91) v1(55.98,20.84) v1(57.12,16.74) v1(57.1,15.89) v1(57.93,16.74) v1(57.93,15.89) v1(59.94,21.45) v1(59.92,20.6) v1(60.75,21.45) v1(60.75,20.6) v1(62.95,9.76) v1(63.45,11.8) v1(65.41,20.44) v1(66.35,4.24) v1(66.33,3.39) v1(66.41,16.34) v1(67.16,4.24) v1(67.16,3.39) v1(68.34,37.47) v1(68.36,38.32) v1(68.45,9.37) v1(68.47,10.22) v1(68.77,16.34) v1(69.17,38.32) v1(69.17,37.47) v1(69.28,10.22) v1(69.28,9.37)
BAT: length 44.8
  Top Layer w0.254: R17.1 13.61,32.98 13.74,32.85 14.8,32.85 14.82,32.87 15.94,32.87 16.12,32.69 16.12,32.04 15.94,31.86 12.94,31.86 12.44,31.36 v1(12.44,24.46) ; v1(12.44,14.93) 12.52,14.85 Q1.3 8.94,14.01 8.66,13.73 8.66,11.66 8.53,11.53 U1.5 5.75,11.53 5.26,11.03 5.26,4.65 5.07,4.46 U17.3
  Bottom Layer w0.254: v1(12.44,14.93) v1(12.44,24.46)
BUSY: length 28.4
  Top Layer w0.254: FPC2.9 63.26,36.22 62.29,37.2 v1(62.29,38.16) ; v1(61.6,22.68) 61.52,22.76 v1(59.34,22.76) ; U8.26 v1(55.98,22.72)
  Bottom Layer w0.254: v1(59.34,22.76) 59.3,22.72 v1(55.98,22.72) ; v1(61.6,22.68) 61.6,26.62 62.77,27.79 62.77,37.03 62.29,37.51 v1(62.29,38.16)
BUZZER: length 35.8
  Top Layer w0.254: 35.43,26.53 37.86,26.53 38.46,27.13 38.46,38.36 37.64,39.18 19.49,39.18 19.28,38.97 R15.2
CS: length 27.2
  Top Layer w0.254: v1(59.03,26.12) 63.37,26.12 63.41,26.08 v1(63.57,26.08) ; FPC2.12 64.76,37.63 v1(64.13,38.26) ; U8.29 55.77,26.53
  Bottom Layer w0.254: v1(55.78,26.52) 56.18,26.12 v1(59.03,26.12) ; v1(64.13,38.26) 64.81,37.58 64.81,27.32 v1(63.57,26.08)
D+: length 14.3
  Top Layer w0.254: U4.5 14.36,27.15 14.36,23.79 13.9,23.33 10.43,23.33 9.81,22.71 9.81,21.05 9.01,20.25 8.6,20.25 ; USB1.B6 8.55,19.25 8.79,19.49 8.79,20.06 8.6,20.25 ; 8.6,20.25 USB1.A6
D-: length 14.2
  Top Layer w0.254: USB1.A7 7.77,19.73 7,19.73 6.76,19.97 6.76,20.58 6.93,20.75 USB1.B7 8.94,20.75 9.4,21.21 9.4,22.88 10.26,23.74 13.19,23.74 13.53,24.08 13.53,25.59 13.09,26.03 U4.6
DC: length 24.9
  Top Layer w0.254: v1(56.12,25.26) 56.11,25.26 56.1,25.26 U8.28 ; v1(59.09,25.13) 62.74,25.13 v1(62.92,25.31) ; v1(64.13,37.29) 64.13,37.14 64.26,37 64.26,34.57
  Bottom Layer w0.254: v1(59.09,25.13) 58.96,25.26 v1(56.12,25.26) ; v1(64.13,37.29) 64.13,27.62 62.92,26.41 v1(62.92,25.31)
DIN: length 58
  Top Layer w0.254: FPC2.14 65.78,34.58 65.78,38.51 65.77,38.52 65.77,38.72 65.43,39.06 55.92,39.06 55.72,38.86 55.72,36.94 55.47,36.69 U8.37 50.65,36.69 v1(50.6,36.74) ; 60.35,8.77 59.26,8.77 58.72,9.31 R20.2 56.07,9.31 55.38,10 v1(55.38,17.49)
  Bottom Layer w0.254: v1(55.38,17.49) 55.01,17.86 55.01,34.39 54.83,34.57 51.06,34.57 50.6,35.03 v1(50.6,36.74)
GDR: length 30.5
  Top Layer w0.254: v1(59.49,36.12) 59.76,35.84 FPC2.2 ; v1(59.48,26.99) 63.66,26.99 64.26,26.39 64.26,25.48 62.95,24.17 62.95,19.58 63.47,19.06 R13.2 64.44,20.98 64.68,21.22 65.93,21.22 66.86,22.15 67.64,22.15
  Bottom Layer w0.254: v1(59.49,36.12) 59.48,36.11 v1(59.48,26.99)
I2C_SCL: length 48.5
  Top Layer w0.254: v1(48.2,35.47) 49.95,35.47 49.99,35.42 U8.36 ; U7.2 27.72,36.89 27.9,36.71 v1(27.9,30.41) ; S1.4 29.09,27.73 R9.1 v1(29.54,28.54) 29.95,28.95 v1(32.65,28.95)
  Bottom Layer w0.254: v1(27.9,30.41) 27.9,28.93 28.29,28.54 v1(29.54,28.54) ; v1(48.2,35.47) 48.2,29.16 47.72,28.68 32.92,28.68 v1(32.65,28.95)
I2C_SDA: length 46
  Top Layer w0.254: U7.13 31.26,36.89 31.57,36.58 31.57,30.43 31.55,30.41 v1(31.55,30.41) ; v1(39.69,30.39) 39.69,28.46 39.8,28.35 49.47,28.35 49.77,28.65 49.77,31.34 50.04,31.61 U8.33 ; v1(31.17,28.26) 31.17,24.83 30.72,24.38 R12.1 27.96,24.51 S1.1
  Bottom Layer w0.254: v1(39.69,30.39) 39.67,30.41 v1(31.55,30.41) 31.55,28.64 v1(31.17,28.26)
IO0: length 33.6
  Top Layer w0.254: v1(26.54,18.6) Q4.3 ; v1(53.11,18.62) 53.43,18.94 U8.25
  Bottom Layer w0.254: v1(26.54,18.6) 53.09,18.6 v1(53.11,18.62)
KEY1: length 31.3
  Top Layer w0.254: 35.43,27.8 32.64,27.8 32.09,27.25 32.09,23.26 31.77,22.94 29.24,22.94 28.91,22.61 R22.2 28.89,7.3 C22.1 28.85,5.15 28.32,5.15 28.08,4.91 KEY1.2
KEY2: length 26.8
  Top Layer w0.254: 35.43,25.26 33.25,25.26 32.84,24.85 32.84,20.44 33.09,20.19 34.08,20.19 34.79,19.48 R23.2 34.79,5.14 C23.1 34.71,5.12 34.03,5.12 33.87,4.96 KEY2.2
KEY3: length 26.1
  Top Layer w0.254: KEY3.2 39.82,4.78 40.15,5.11 C24.1 40.73,5.14 R24.2 40.73,16.64 39.94,17.43 38.02,17.43 37.43,18.02 37.43,23.75 37.09,24.09 35.53,24.09 35.43,23.99
MISO: length 38.2
  Top Layer w0.254: U8.31 56.79,29.07 56.83,29.03 v1(56.83,28.97) ; v1(56.83,26.94) 56.83,19.96 56.38,19.51 55.07,19.51 54.02,18.46 54.02,4.09 55.12,2.99 R18.2 58.9,2.99 59,3.09 59,4.11 59.26,4.37 60.35,4.37
  Bottom Layer w0.254: v1(56.83,26.94) v1(56.83,28.97)
PREVGH: length 17.5
  Top Layer w0.254: v1(70.7,36.4) 69.62,36.4 69.27,36.05 FPC2.21 ; v1(72.65,28.9) 72.65,28.84 72.64,28.83 C12.1 72.69,27.75 72.69,23.8
  Bottom Layer w0.254: v1(70.7,36.4) 72.47,36.4 72.65,36.22 v1(72.65,28.9)
PREVGL: length 19.5
  Top Layer w0.254: 70.26,34.57 70.26,33.46 70.47,33.26 72.45,33.26 72.63,33.08 C14.1 72.65,32 73.93,32 74.29,31.64 74.29,29.95 73.88,29.53 65.12,29.53 64.69,29.1 D7.2
RESE: length 35.1
  Top Layer w0.254: v1(60.3,37.4) 60.3,34.87 60.31,34.86 ; 67.64,20.85 66.77,20.85 66.45,20.53 R14.2 66.45,18.5 66.26,18.31 58.42,18.31 58.07,18.66 58.07,26.91 v1(58.31,27.15)
  Bottom Layer w0.254: v1(60.3,37.4) 58.77,37.4 58.31,36.94 v1(58.31,27.15)
REST: length 26.8
  Top Layer w0.254: v1(62.25,24.04) 62.21,24.08 v1(58.88,24.08) ; FPC2.10 63.77,36.75 63.49,37.02 63.49,37.76 v1(63.32,37.94) ; U8.27 v1(55.85,23.99)
  Bottom Layer w0.254: v1(62.25,24.04) 62.25,26.43 63.32,27.5 v1(63.32,37.94) ; v1(55.85,23.99) 58.79,23.99 v1(58.88,24.08)
RTS: length 70.2
  Top Layer w0.254: v1(39.7,35.39) 39.03,34.72 39.03,25.65 39.83,24.85 50.84,24.85 51.56,24.13 51.56,8.02 48.72,5.17 R8.1 49.6,5.15 49.91,4.84 RESET1.1 ; v1(37.63,35.37) 35.49,35.37 35.43,35.42 33.62,35.42 33.18,34.98 33.18,30.03 32.93,29.77 23,29.77 22.31,29.09 Q5.3
  Bottom Layer w0.254: v1(37.63,35.37) 37.65,35.39 v1(39.7,35.39)
RXD0: length 54.6
  Top Layer w0.254: U4.2 18.18,24.75 18.46,24.47 20.06,24.47 20.38,24.79 20.38,27.16 20.6,27.38 24.34,27.38 24.84,26.88 R11.1 24.85,22.48 v1(27.96,22.48) ; v1(50.63,32.79) 50.72,32.88 U8.34
  Bottom Layer w0.254: v1(27.96,22.48) 49.38,22.48 50.39,23.49 50.39,32.55 v1(50.63,32.79)
SCLK: length 60
  Top Layer w0.254: 56.84,27.8 57.44,27.24 57.44,27.23 57.47,27.2 57.47,19.12 56.97,18.63 55.04,18.63 54.45,18.04 54.45,5.51 55.21,4.75 R19.2 58.69,4.75 58.94,5 58.94,6.25 59.26,6.57 60.35,6.57 ; 56.84,27.8 U8.30 ; 56.84,27.8 60.59,27.8 61.25,28.46 61.25,31.95 62.03,32.73 v1(62.03,33.1) ; FPC2.13 65.26,38.37 v1(65.14,38.25)
  Bottom Layer w0.254: v1(65.14,38.25) 64.48,38.91 61.31,38.91 61.13,38.73 61.13,34 v1(62.03,33.1)
SD_SS: length 24.1
  Top Layer w0.254: v1(58.26,12.73) 58.26,11.74 R21.2 61.44,11.73 61.85,11.32 61.85,10.21 61.51,9.87 60.35,9.87 ; U8.23 48.88,13.11 48.87,13.1 v1(48.87,12.85)
  Bottom Layer w0.254: v1(48.87,12.85) 58.14,12.85 v1(58.26,12.73)
TXD0: length 51.3
  Top Layer w0.254: R10.1 23.01,23.34 v1(22.55,23.8) 17.32,23.8 16.91,24.22 U4.3 ; U8.35 49.74,34.15 v1(49.66,34.23)
  Bottom Layer w0.254: v1(22.55,23.8) 49.16,23.8 49.66,24.3 v1(49.66,34.23)
$1N1008: length 6.7
  Top Layer w0.254: C7.1 56.16,33 56.42,33.25 60.6,33.25 60.77,33.42 FPC2.4
$1N1009: length 4.9
  Top Layer w0.254: 61.29,34.2 61.29,32.7 60.84,32.25 C8.1
$1N1010: length 1.6
  Top Layer w0.254: FPC2.24 71.87,34.57 C15.1
$1N1013: length 3.1
  Top Layer w0.254: FPC2.22 69.76,32.75 70.61,31.91 C13.1
$1N1016: length 2.7
  Top Layer w0.254: C11.1 68.77,31.94 FPC2.20
$1N1017: length 7.3
  Top Layer w0.254: FPC2.18 67.76,33.64 67.64,33.52 63.31,33.52 62.89,33.09 C9.1
$1N1018: length 6
  Top Layer w0.254: C10.1 64.76,32.95 64.89,33.08 68.01,33.08 68.26,33.33 FPC2.19
$1N1037: length 7.2
  Top Layer w0.254: L1.2 71.97,21.5 Q3.3 69.29,21.55 D8.2 68.71,24.38 C18.2
$1N1038: length 4.6
  Top Layer w0.254: 67.54,25.83 C18.1 ; 67.54,25.83 65.14,25.83 ; 67.54,25.83 68.09,26.38 D7.1
$1N3398: length 1.9
  Top Layer w0.254: R3.2 15.08,8.98 U1.2
$1N3399: length 8.6
  Top Layer w0.254: R4.1 11.11,5.94 11.58,5.47 11.58,3.26 11.76,3.08 12.24,3.08 DONE1.1 14.9,3.19 CHRG1.1
$1N3400: length 12.9
  Top Layer w0.254: U1.6 6.25,10.25 5.92,9.93 5.92,3.59 6.32,3.19 DONE1.2
$1N3401: length 14.3
  Top Layer w0.254: CHRG1.2 16.6,3.13 15.97,3.13 15.79,3.31 15.79,6.2 15.15,6.84 8.89,6.84 8.65,7.08 8.65,8.83 8.5,8.98 U1.7
$1N3410: length 13
  Top Layer w0.254: USB1.A5 6.4,21.25 6.11,20.96 6.11,18.69 6.58,18.22 7.75,18.22 USB1.B5 13.37,18.25 13.83,17.79 R1.2
$1N4072: length 2.8
  Top Layer w0.254: U4.1 19.53,27.24 Q2.3
$1N4223: length 12.9
  Top Layer w0.254: R7.2 16.91,19.51 U4.14 v1(16.91,22.72) ; v1(23.27,24.88) 23.26,24.89 Q5.2
  Bottom Layer w0.254: v1(23.27,24.88) 17.26,24.88 16.91,24.53 v1(16.91,22.72)
$1N5097: length 1.8
  Top Layer w0.254: Q5.1 21.36,24.64 R6.1
$1N5158: length 1.9
  Top Layer w0.254: R7.1 20.24,19.5 Q4.1
$1N5192: length 13.7
  Top Layer w0.254: U4.13 15.64,23.05 15.96,23.37 20.87,23.37 R6.2 21.23,17.83 21.05,17.65 Q4.2
$1N5475: length 6.5
  Top Layer w0.254: 6.56,37.08 6.56,37.88 6.81,38.13 Q7.3
$1N5476: length 3.5
  Top Layer w0.254: R15.1 17.69,37.18 Q7.1
$1N5477: length 12.8
  Top Layer w0.254: R17.2 7.41,35.69 6.56,34.84 6.56,29.48
$1N22750: length 9.6
  Top Layer w0.254: 18.22,32.87 18.22,34.85 C5.2 20.04,34.99 C6.2 21.03,34.91 21.21,34.73 21.21,32.18 21.58,31.81 U7.6
$1N29241: length 11.5
  Top Layer w0.254: Q1.2 17.44,14.96 D4.1 20.35,14.69 C2.2 20.55,14.49 U2.3 20.55,11.93 20.78,11.7 22.37,11.7 22.55,11.88 U2.1

## Copper pours and planes (outline as drawn; the poured copper is in the pictures)
3V3 on Top Layer: 21.88,9.54 21.88,10.58 22.27,10.97 24.44,10.97 24.83,10.58 24.83,5.64 24.52,5.33 22.31,5.33 22.01,5.62 22.01,9.28 22,9.29 22,9.42
GND on Top Layer: -1.06,41.07 76.28,41.07 76.28,-1.41 -1.06,-1.41
GND on Bottom Layer: -2.97,42.69 77.43,42.69 77.43,-4.08 -2.97,-4.08
